# EAGLE schematic 8085_try2 (EAGLE 9.2.0)
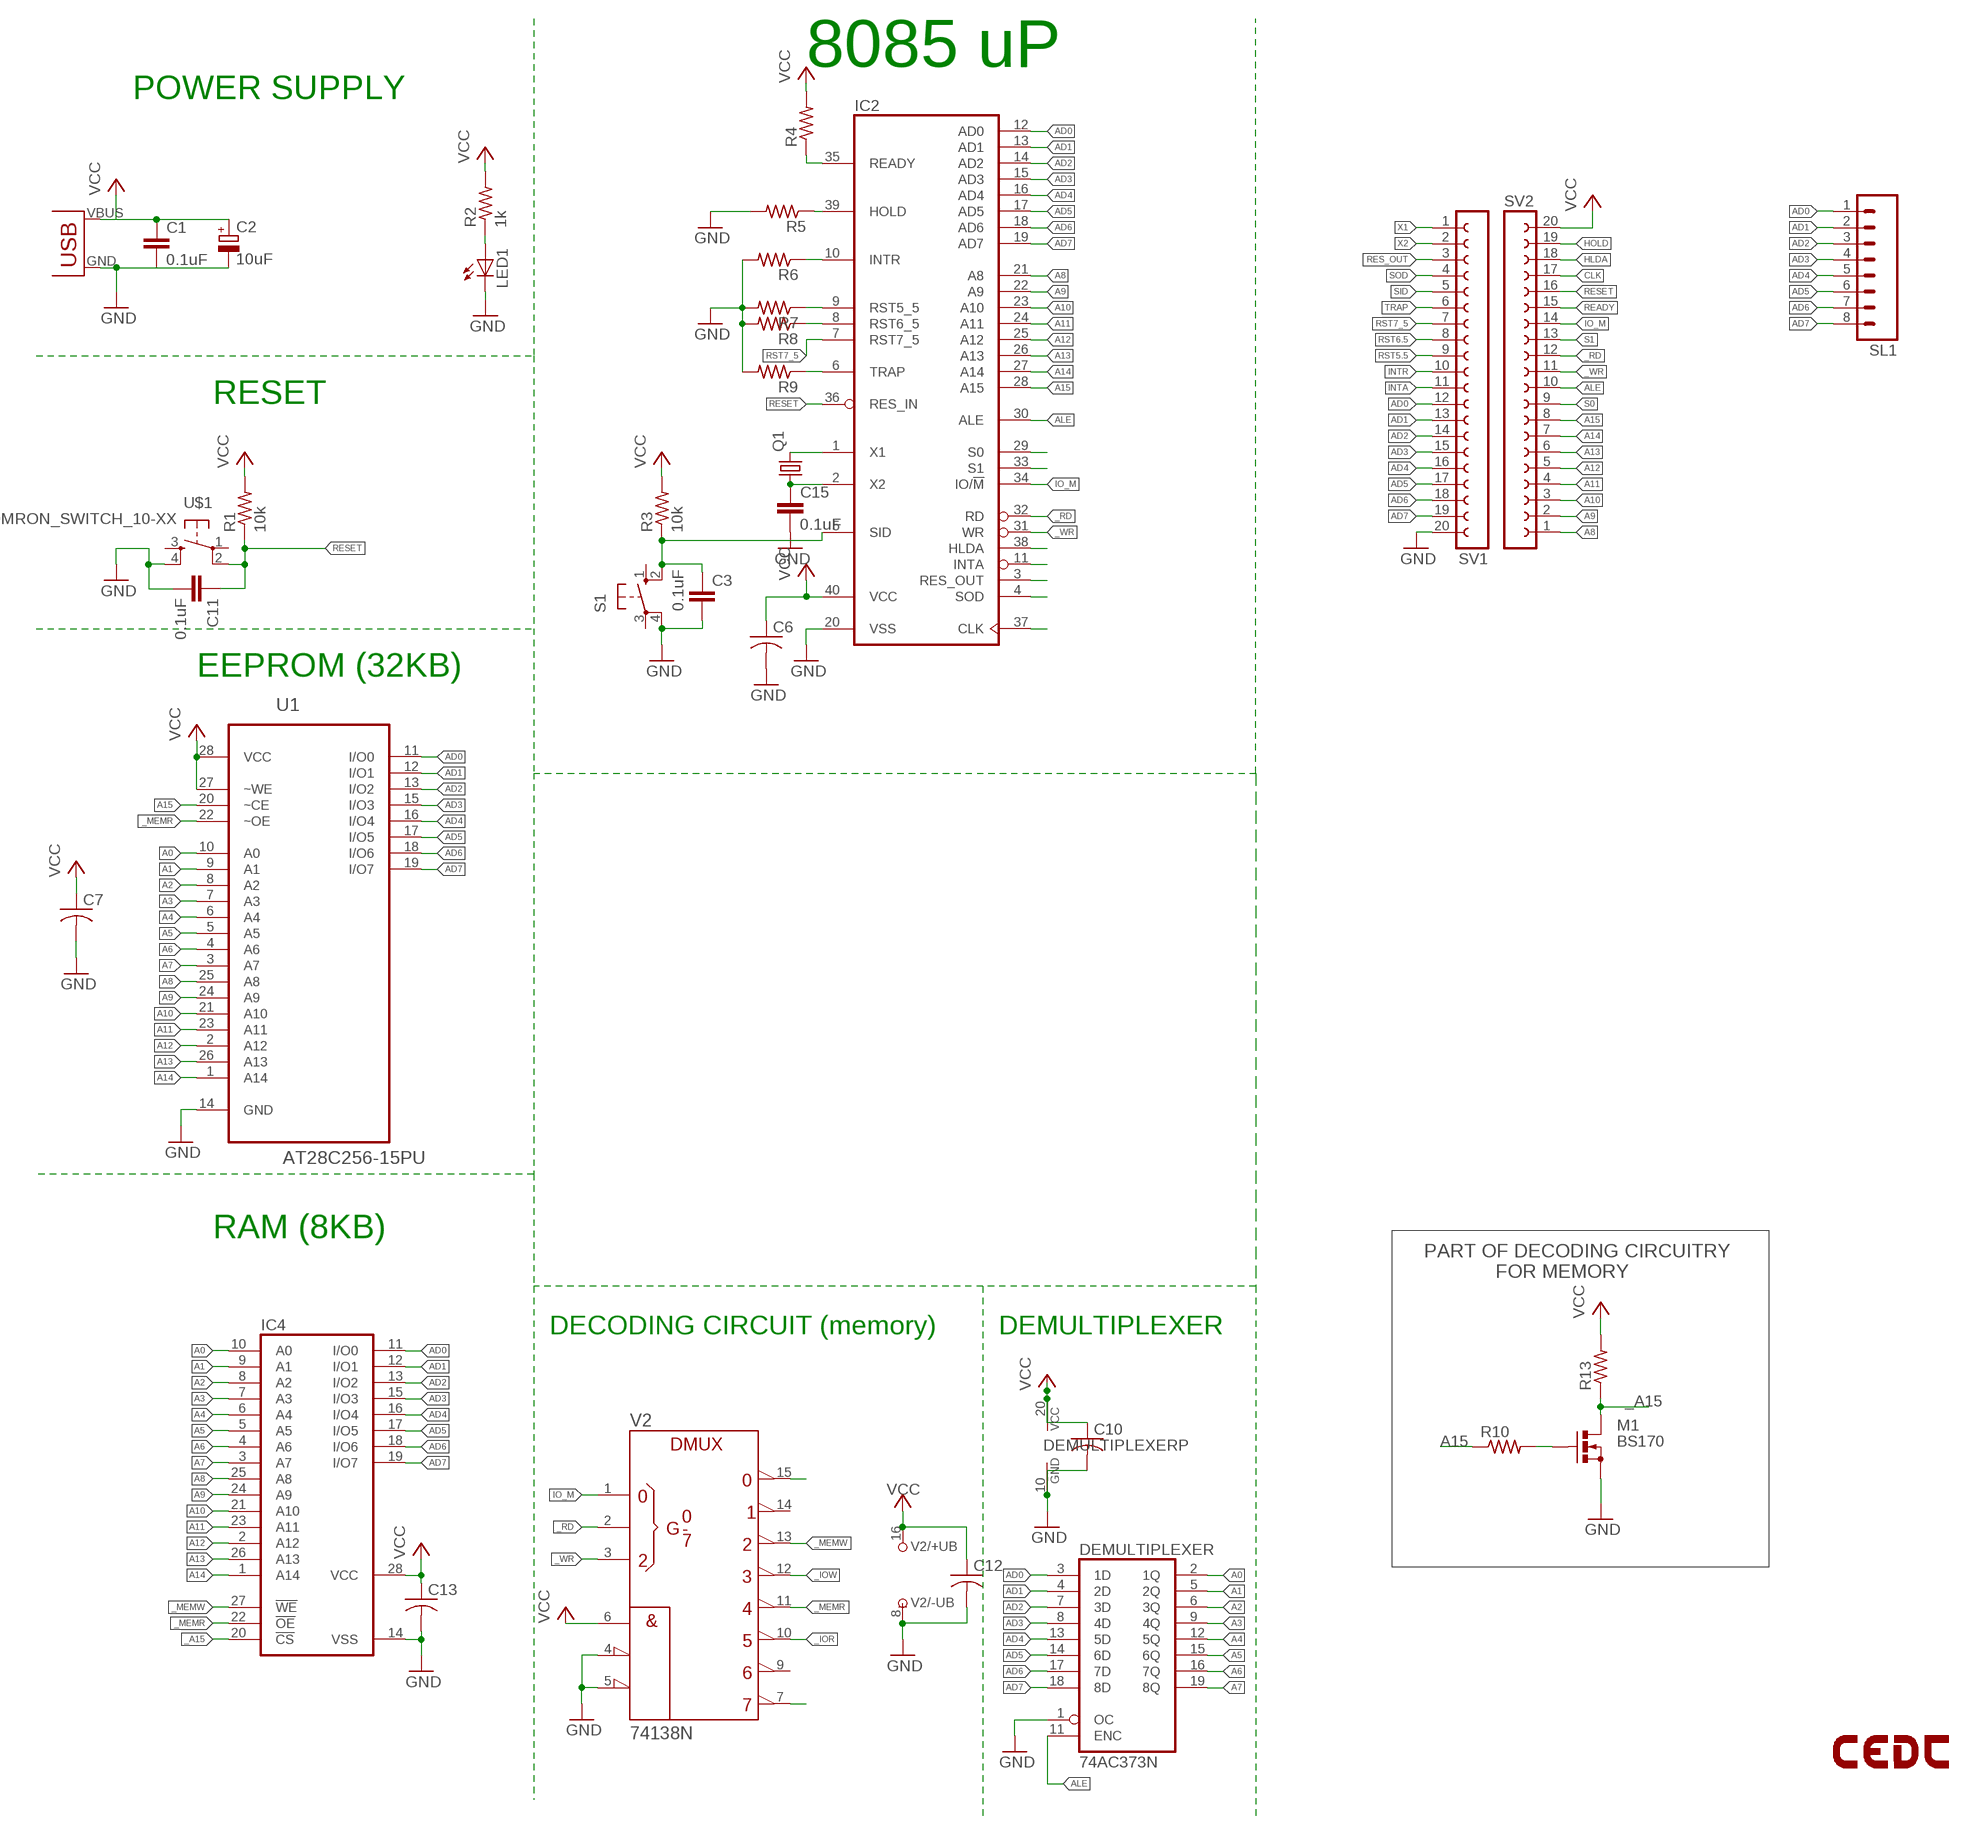
[diagram p0: schematic, sheet 1]

## Parts
C1  0.1uF  C2,5-3  [C2.5-3]
C2  10uF  CPOL-EUE2.5-6  [E2,5-6]
C3  0.1uF  C2,5-3  [C2.5-3]
C6  CAP0805  [C0805]
C7  CAP0805  [C0805]
C10  CAP0805  [C0805]
C11  0.1uF  C2,5-3  [C2.5-3]
C12  CAP0805  [C0805]
C13  CAP0805  [C0805]
C15  0.1uF  C2,5-3  [C2.5-3]
DEMULTIPLEXER  74AC373N  [DIL20]
IC2  8085  [DIL40]
IC4  62256P  [DIL28-6]
LED1  LED3MM  [LED3MM]
LOGO1  LOGO-CEDTBOT-18MM  [LOGO-CEDT-BOT-18MM]
M1  BS170  [SOT54E]
Q1  CRYSTALHC49US  [HC49US]
R1  10k  RESISTOR0207/7  [0207/7]
R2  1k  RESISTOR0207/7  [0207/7]
R3  10k  RESISTOR0207/7  [0207/7]
R4  RESISTOR0805  [R0805]
R5  RESISTOR0805  [R0805]
R6  RESISTOR0805  [R0805]
R7  RESISTOR0805  [R0805]
R8  RESISTOR0805  [R0805]
R9  RESISTOR0805  [R0805]
R10  R-US_0204/5  [0204/5]
R13  R-US_0204/5  [0204/5]
S1  40-XX  [B3F-40XX]
SL1  M08  [08P]
SV1  FE20-1  [FE20]
SV2  FE20-1  [FE20]
U1  AT28C256-15PU  [DIP254P1524X482-28]
U$1  OMRON_SWITCH_10-XX  [B3F-10XX]
U$2  USB(POWER)  [USB(POWER)]
V2  74138N  [DIL16]

## Nets
_A15: IC4.20(!CS) M1.D R13.1
_IOR: V2.10(Y5)
_IOW: V2.12(Y3)
_MEMR: IC4.22(!OE) U1.22(~OE) V2.11(Y4)
_MEMW: IC4.27(!WE) V2.13(Y2)
_RD: IC2.32(RD) SV2.12 V2.2(B)
_WR: IC2.31(WR) SV2.11 V2.3(C)
A0: DEMULTIPLEXER.2(1Q) IC4.10(A0) U1.10(A0)
A1: DEMULTIPLEXER.5(2Q) IC4.9(A1) U1.9(A1)
A2: DEMULTIPLEXER.6(3Q) IC4.8(A2) U1.8(A2)
A3: DEMULTIPLEXER.9(4Q) IC4.7(A3) U1.7(A3)
A4: DEMULTIPLEXER.12(5Q) IC4.6(A4) U1.6(A4)
A5: DEMULTIPLEXER.15(6Q) IC4.5(A5) U1.5(A5)
A6: DEMULTIPLEXER.16(7Q) IC4.4(A6) U1.4(A6)
A7: DEMULTIPLEXER.19(8Q) IC4.3(A7) U1.3(A7)
A8: IC2.21(A8) IC4.25(A8) SV2.1 U1.25(A8)
A9: IC2.22(A9) IC4.24(A9) SV2.2 U1.24(A9)
A10: IC2.23(A10) IC4.21(A10) SV2.3 U1.21(A10)
A11: IC2.24(A11) IC4.23(A11) SV2.4 U1.23(A11)
A12: IC2.25(A12) IC4.2(A12) SV2.5 U1.2(A12)
A13: IC2.26(A13) IC4.26(A13) SV2.6 U1.26(A13)
A14: IC2.27(A14) IC4.1(A14) SV2.7 U1.1(A14)
A15: IC2.28(A15) R10.1 SV2.8 U1.20(~CE)
AD0: DEMULTIPLEXER.3(1D) IC2.12(AD0) IC4.11(I/O0) SL1.1 SV1.12 U1.11(I/O0)
AD1: DEMULTIPLEXER.4(2D) IC2.13(AD1) IC4.12(I/O1) SL1.2 SV1.13 U1.12(I/O1)
AD2: DEMULTIPLEXER.7(3D) IC2.14(AD2) IC4.13(I/O2) SL1.3 SV1.14 U1.13(I/O2)
AD3: DEMULTIPLEXER.8(4D) IC2.15(AD3) IC4.15(I/O3) SL1.4 SV1.15 U1.15(I/O3)
AD4: DEMULTIPLEXER.13(5D) IC2.16(AD4) IC4.16(I/O4) SL1.5 SV1.16 U1.16(I/O4)
AD5: DEMULTIPLEXER.14(6D) IC2.17(AD5) IC4.17(I/O5) SL1.6 SV1.17 U1.17(I/O5)
AD6: DEMULTIPLEXER.17(7D) IC2.18(AD6) IC4.18(I/O6) SL1.7 SV1.18 U1.18(I/O6)
AD7: DEMULTIPLEXER.18(8D) IC2.19(AD7) IC4.19(I/O7) SL1.8 SV1.19 U1.19(I/O7)
ALE: DEMULTIPLEXER.11(ENC) IC2.30(ALE) SV2.10
CLK: IC2.37(CLK) SV2.17
GND: C1.2 C2.- C3.2 C6.2 C7.2 C10.2 C11.2 C12.2 C13.2 C15.2 DEMULTIPLEXER.1(OC) DEMULTIPLEXER.10(GND) IC2.20(VSS) IC4.14(VSS) LED1.K(C) M1.S R5.2 R6.2 R7.2 R8.2 R9.2 S1.4(P1) SV1.20 U1.14(GND) U$1.4(S1) U$2.GND V2.4(!G2A) V2.5(!G2B) V2.8(-UB)
HLDA: IC2.38(HLDA) SV2.18
HOLD: IC2.39(HOLD) R5.1 SV2.19
INTA: IC2.11(INTA) SV1.11
INTR: IC2.10(INTR) R6.1 SV1.10
IO_M: IC2.34(IO/!M) SV2.14 V2.1(A)
N$1: M1.G R10.2
N$7: LED1.A R2.1
N$23: V2.15(Y0)
N$30: V2.7(Y7)
READY: IC2.35(READY) R4.1 SV2.15
RES_OUT: IC2.3(RES_OUT) SV1.3
RESET: C11.1 IC2.36(RES_IN) R1.1 SV2.16 U$1.2(P1)
RST5.5: IC2.9(RST5_5) R7.1 SV1.9
RST6.5: IC2.8(RST6_5) R8.1 SV1.8
RST7_5: IC2.7(RST7_5) SV1.7
S0: IC2.29(S0) SV2.9
S1: IC2.33(S1) SV2.13
SID: C3.1 IC2.5(SID) R3.1 S1.2(S1) SV1.5
SOD: IC2.4(SOD) SV1.4
TRAP: IC2.6(TRAP) R9.1 SV1.6
VCC: C1.1 C2.+ C6.1 C7.1 C10.1 C12.1 C13.1 DEMULTIPLEXER.20(VCC) IC2.40(VCC) IC4.28(VCC) R1.2 R2.2 R3.2 R4.2 R13.2 SV2.20 U1.27(~WE) U1.28(VCC) U$2.VBUS(VCC) V2.6(G1) V2.16(+UB)
X1: IC2.1(X1) Q1.2 SV1.1
X2: C15.1 IC2.2(X2) Q1.1 SV1.2
Unconnected: S1.1(S) S1.3(P) U$1.1(P) U$1.3(S) V2.9(Y6) V2.14(Y1)

## Notes on the sheet
- 8085 uP
- POWER SUPPLY
- RESET
- EEPROM (32KB)
- RAM (8KB)
- PART OF DECODING CIRCUITRY 
               FOR MEMORY
- DECODING CIRCUIT (memory) | DEMULTIPLEXER

## Library data of the parts
C1 C3 C11 C15 = capacitor-wima:C: CAPACITOR naming: grid - package width
C2 = rcl:CPOL-EU: POLARIZED CAPACITOR, European symbol; SPICEPREFIX: C
C6 C7 C10 C12 C13 = CEDT_JANUARY_2015_v7:CAP
DEMULTIPLEXER = 74xx-eu:74*373: Octal D type transparent LATCH, edge triggered
IC2 = micro-intel:8085: MICROCOMPUTER/PERIPHERAL DEVICE; OC_FARNELL: unknown; OC_NEWARK: unknown
IC4 = memory-hitachi:62256P: MEMORY; OC_FARNELL: unknown; OC_NEWARK: unknown
LED1 = CEDT_JANUARY_2015_v7:LED
LOGO1 = CEDT_JANUARY_2015_v7:LOGO-CEDT
M1 = transistor-small-signal:BS170: N-CHANNEL MOS FET
Q1 = CEDT_JANUARY_2015_v7:CRYSTAL: Crystals Various standard crystals. Proven footprints. Spark Fun Electronics SKU : COM-00534
R1-R9 = CEDT_JANUARY_2015_v7:RESISTOR
R10 R13 = resistor:R-US_: RESISTOR, American symbol
S1 = switch-omron:40-XX: OMRON SWITCH; MF: OMRON COMPONENTS USA; MPN: B3F-4000; OC_FARNELL: 176434; OC_NEWARK: 36K3105
SL1 = con-amp-quick:M08: AMP QUICK CONNECTOR; OC_FARNELL: unknown; OC_NEWARK: unknown
SV1 SV2 = con-lsta:FE20-1: FEMALE HEADER; OC_FARNELL: unknown; OC_NEWARK: unknown
U1 = AT28C256-15PU:AT28C256-15PU: Paged Parallel EEPROM; AVAILABILITY: Unavailable; DESCRIPTION: AT28C256 Series 256 Kb _32 K x 8_ 5.5 V Paged Parallel EEPROM - DIP-28; MF: Microchip; MP: AT28C256-15PU; PACKAGE: DIP-28 Microchip; PRICE: None
U$1 = CEDT_JANUARY_2015_v7:OMRON_SWITCH
U$2 = CEDT_JANUARY_2015_v7:USB(POWER)
V2 = 74ttl-din:74*138: 3-line to 8-line DECODER/DEMULTIPLEXER